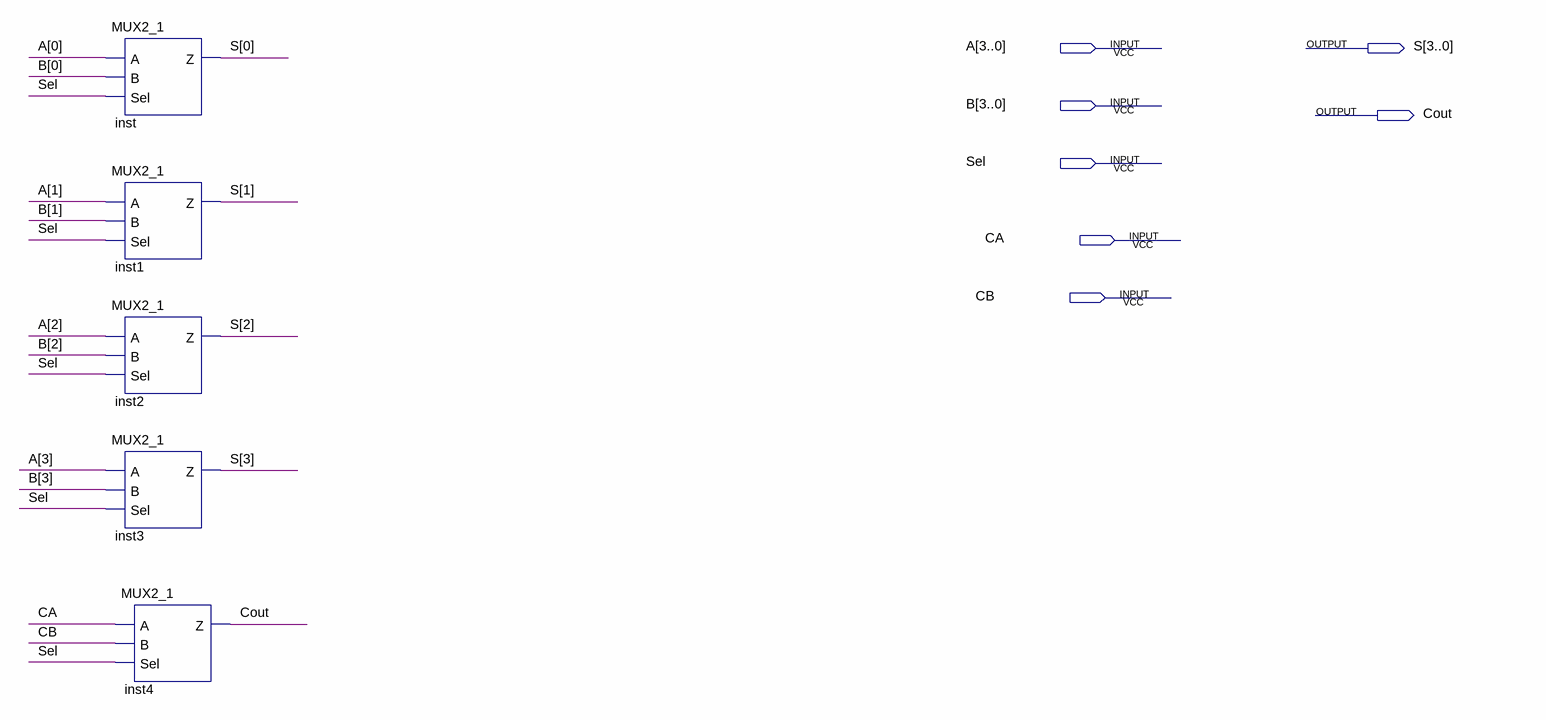
[diagram p0: schematic sheet]
// Quartus schematic MUX.bdf as structural Verilog: 5 symbols, 7 pins
module MUX (
  input  [3:0] A,
  input  [3:0] B,
  input  Sel,
  input  CA,
  input  CB,
  output [3:0] S,
  output Cout
);

  MUX2_1 inst (.A(A[0]), .B(B[0]), .Sel(Sel), .Z(S[0]));
  MUX2_1 inst1 (.A(A[1]), .B(B[1]), .Sel(Sel), .Z(S[1]));
  MUX2_1 inst2 (.A(A[2]), .B(B[2]), .Sel(Sel), .Z(S[2]));
  MUX2_1 inst3 (.A(A[3]), .B(B[3]), .Sel(Sel), .Z(S[3]));
  MUX2_1 inst4 (.A(CA), .B(CB), .Sel(Sel), .Z(Cout));
endmodule
